# EAGLE design hitpoint (EAGLE 7.3.0)
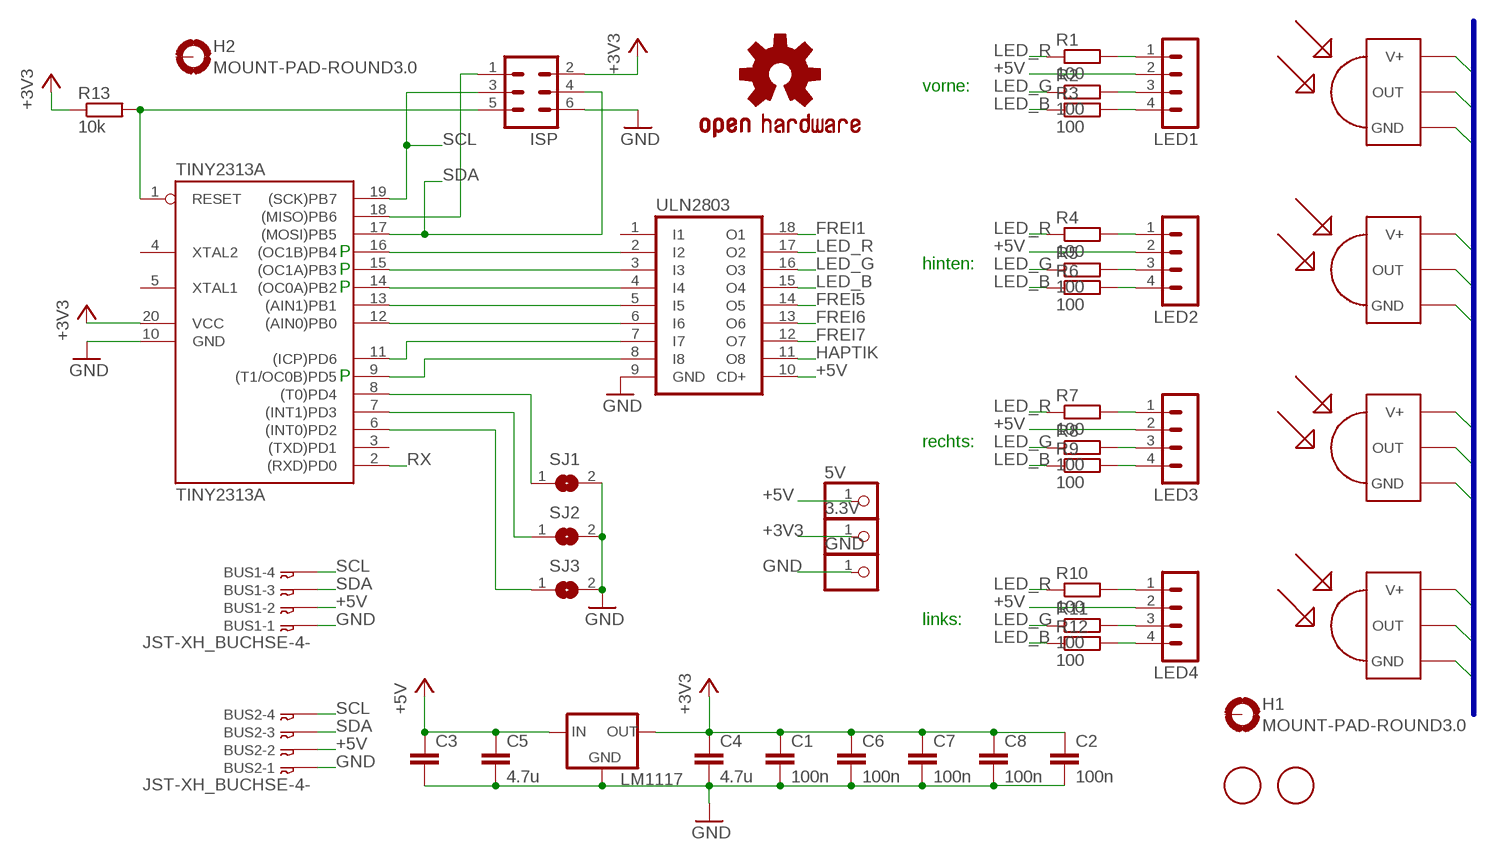
[diagram p0: schematic, sheet 1]

## Parts
3.3V  PIN-HEADER-1  [PIN-HEADER-1]
5V  PIN-HEADER-1  [PIN-HEADER-1]
BUS1  JST-XH_BUCHSE-4-  [JST-XH_BUCHSE-4]
BUS2  JST-XH_BUCHSE-4-  [JST-XH_BUCHSE-4]
C1  100n  C_EU0603  [0603]
C2  100n  C_EU0603  [0603]
C3  C_EUCAP_UNIVERSAL  [C_UNIVERSAL]
C4  4.7u  C_EU0805  [0805]
C5  4.7u  C_EU0805  [0805]
C6  100n  C_EU0603  [0603]
C7  100n  C_EU0603  [0603]
C8  100n  C_EU0603  [0603]
GND  PIN-HEADER-1  [PIN-HEADER-1]
H1  MOUNT-PAD-ROUND3.0  [3,0-PAD]
H2  MOUNT-PAD-ROUND3.0  [3,0-PAD]
ISP  PIN-HEADER-3X2  [PIN-HEADER-3X2]
LED1  PIN-HEADER-4  [PIN-HEADER-4]
LED2  PIN-HEADER-4  [PIN-HEADER-4]
LED3  PIN-HEADER-4  [PIN-HEADER-4]
LED4  PIN-HEADER-4  [PIN-HEADER-4]
LM1117  LM1117_3V3_REGULATOR  [SOT223]
LOGO1  OSHW-LOGOM  [OSHW-LOGO-M]
LOGO2  OSHW-LOGOM  [OSHW-LOGO-M]
R1  100  R_EU0603  [0603]
R2  100  R_EU0603  [0603]
R3  100  R_EU0603  [0603]
R4  100  R_EU0603  [0603]
R5  100  R_EU0603  [0603]
R6  100  R_EU0603  [0603]
R7  100  R_EU0603  [0603]
R8  100  R_EU0603  [0603]
R9  100  R_EU0603  [0603]
R10  100  R_EU0603  [0603]
R11  100  R_EU0603  [0603]
R12  100  R_EU0603  [0603]
R13  10k  R_EU0603  [0603]
SJ1  SJ  [SJ]
SJ2  SJ  [SJ]
SJ3  SJ  [SJ]
TINY2313A  TINY2313A  [SO20LVERSTUMMELT]
U$1  TSOP4338  [TSOP4338]
U$2  TSOP4338  [TSOP4338]
U$3  TSOP4338  [TSOP4338]
U$4  TSOP4338  [TSOP4338]
U$5  FIDUCIAL  [FIDUCIAL_1MM]
U$6  FIDUCIAL  [FIDUCIAL_1MM]
ULN2803  ULN2803ASO18  [SO18W]

## Nets
+3V3: 3.3V.1 C1.1 C2.1 C4.1 C6.1 C7.1 C8.1 ISP.2 LM1117.2(OUT) LM1117.4(OUT) R13.1 TINY2313A.20(VCC) U$1.VCC(V+) U$2.VCC(V+) U$3.VCC(V+) U$4.VCC(V+)
+5V: 5V.1 BUS1.P$2 BUS2.P$2 C3.1 C3.1B C5.1 LED1.2 LED2.2 LED3.2 LED4.2 LM1117.3(IN) ULN2803.10(CD+)
FREI1: ULN2803.18(O1)
FREI5: ULN2803.14(O5)
FREI6: ULN2803.13(O6)
FREI7: ULN2803.12(O7)
GND: BUS1.P$1 BUS2.P$1 C1.2 C2.2 C3.2 C3.2B C4.2 C5.2 C6.2 C7.2 C8.2 GND.1 ISP.6 LM1117.1(GND) SJ1.2 SJ2.2 SJ3.2 TINY2313A.10(GND) U$1.GND U$2.GND U$3.GND U$4.GND ULN2803.9(GND)
HAPTIK: ULN2803.11(O8)
LED_B: R3.1 R6.1 R9.1 R12.1 ULN2803.15(O4)
LED_G: R2.1 R5.1 R8.1 R11.1 ULN2803.16(O3)
LED_R: R1.1 R4.1 R7.1 R10.1 ULN2803.17(O2)
N$1: ISP.1 TINY2313A.18((MISO)PB6)
N$2: SJ1.1 TINY2313A.8((T0)PD4)
N$3: TINY2313A.16((OC1B)PB4) ULN2803.2(I2)
N$4: TINY2313A.15((OC1A)PB3) ULN2803.3(I3)
N$5: LED4.1 R10.2
N$6: LED4.3 R11.2
N$7: TINY2313A.14((OC0A)PB2) ULN2803.4(I4)
N$8: TINY2313A.13((AIN1)PB1) ULN2803.5(I5)
N$9: TINY2313A.12((AIN0)PB0) ULN2803.6(I6)
N$10: TINY2313A.11((ICP)PD6) ULN2803.7(I7)
N$11: TINY2313A.9((T1/OC0B)PD5) ULN2803.8(I8)
N$12: LED4.4 R12.2
N$13: LED3.1 R7.2
N$14: LED3.3 R8.2
N$15: LED3.4 R9.2
N$16: LED2.1 R4.2
N$17: LED2.3 R5.2
N$18: SJ2.1 TINY2313A.7((INT1)PD3)
N$19: SJ3.1 TINY2313A.6((INT0)PD2)
N$22: LED2.4 R6.2
N$23: ISP.5 R13.2 TINY2313A.1(RESET)
N$24: LED1.1 R1.2
N$25: LED1.3 R2.2
N$26: LED1.4 R3.2
RX: TINY2313A.2((RXD)PD0) U$1.OUT U$2.OUT U$3.OUT U$4.OUT
SCL: BUS1.P$4 BUS2.P$4 ISP.3 TINY2313A.19((SCK)PB7)
SDA: BUS1.P$3 BUS2.P$3 ISP.4 TINY2313A.17((MOSI)PB5)
Unconnected: H1.B3,0(MOUNT) H2.B3,0(MOUNT) TINY2313A.3((TXD)PD1) TINY2313A.4(XTAL2) TINY2313A.5(XTAL1) ULN2803.1(I1)

## Buses
+3V3,GND,RX

## Notes on the sheet
- vorne:
- P
- hinten:
- P
- P
- P
- rechts:
- links:

## Library data of the parts
3.3V 5V GND = wz:PIN-HEADER-1: PIN HEADER
BUS1 BUS2 = wz:JST-XH_BUCHSE-4: JST CONNECTOR
C1-C8 = wz:C_EU: CAPACITOR, European symbol
H1 H2 = holes:MOUNT-PAD-ROUND: MOUNTING PAD, round
ISP = wz:PIN-HEADER-3X2: PIN HEADER; OC_FARNELL: unknown; OC_NEWARK: unknown
LED1-LED4 = wz:PIN-HEADER-4: PIN HEADER; OC_FARNELL: unknown; OC_NEWARK: unknown
LM1117 = wz:LM1117_3V3_REGULATOR: 1117
LOGO1 LOGO2 = SparkFun-Aesthetics:OSHW-LOGO: Open Source Hardware Logo This logo indicates the piece of hardware it is found on incorporates a OSHW license and/or adheres to the definition of open source hardware found here: http://freedomdefined.org/OSHW
R1-R13 = wz:R_EU: RESISTOR, European symbol
SJ1-SJ3 = jumper:SJ: SMD solder JUMPER
TINY2313A = wz:TINY2313A: MICROCONTROLLER 2 Kbytes FLASH 128 bytes SRAM 128 bytes EEPROM UART
U$1-U$4 = wz:TSOP4338: IR Receiver and Demodulator
U$5 U$6 = adafruit:FIDUCIAL: For use by pick and place machines to calibrate the vision/machine, 1mm By microbuilder.eu
ULN2803 = wz:ULN2803A: DRIVER ARRAY

## Net classes
0 default: width 0.016 mm

## Board
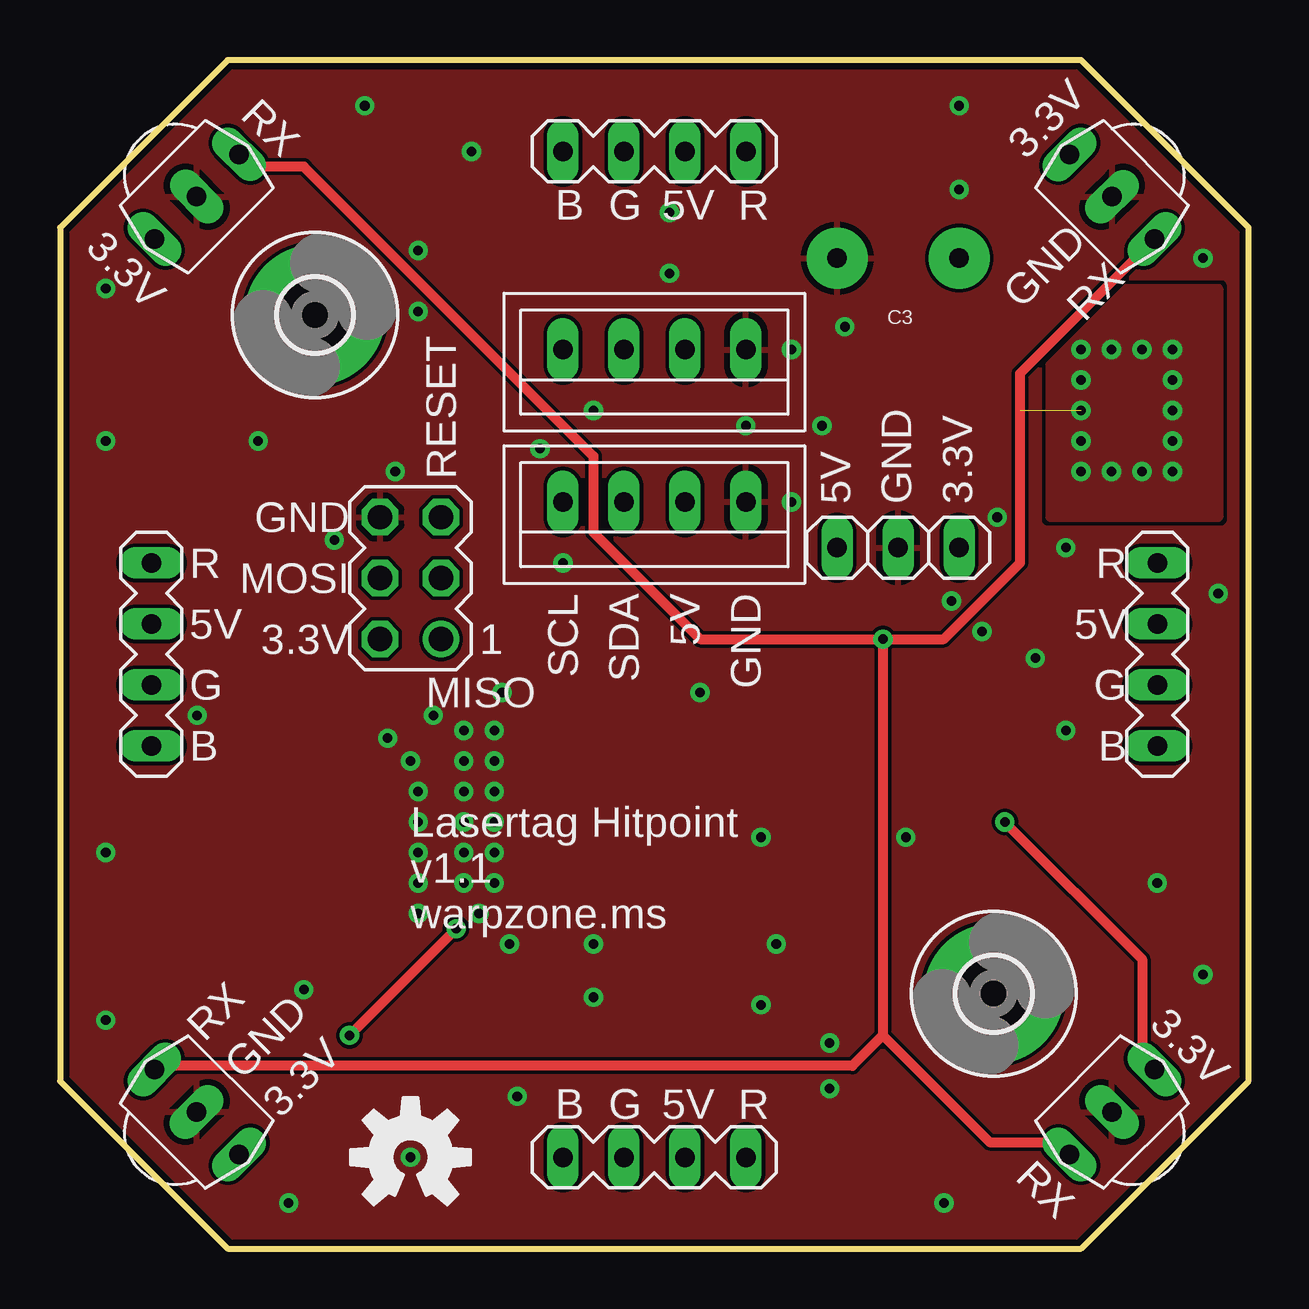
[diagram p1: board, top side]
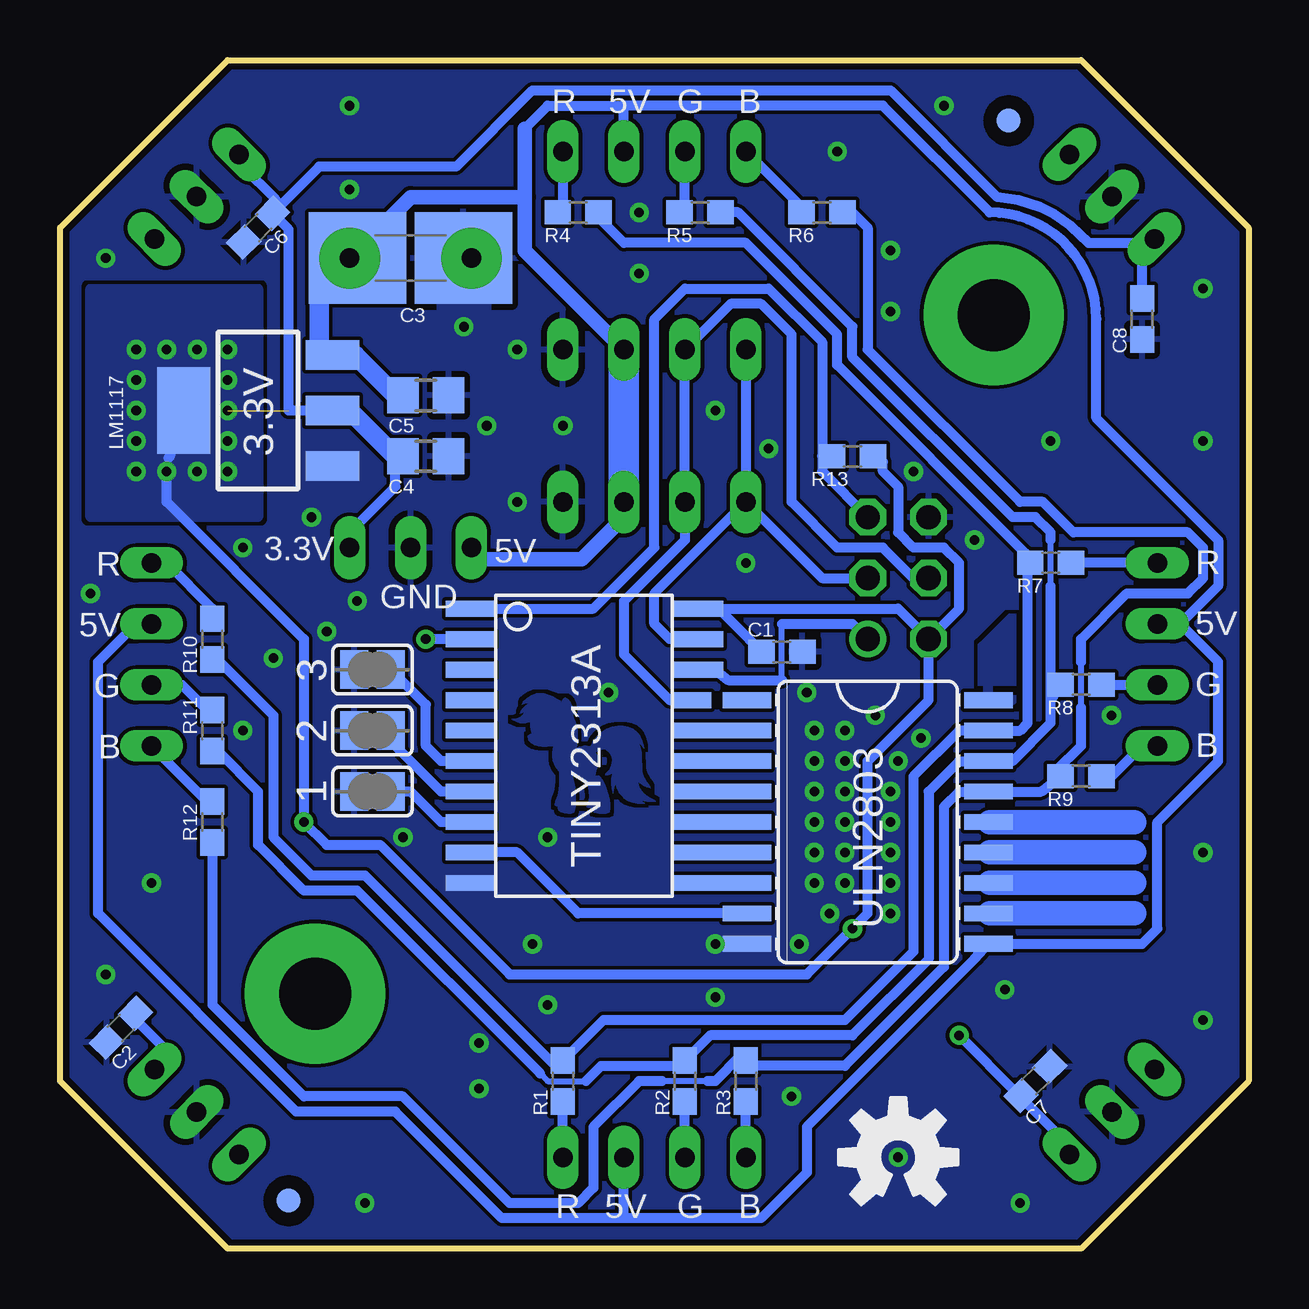
[diagram p2: board, bottom side, seen from below]

Size 49.53 x 49.53 mm. Coordinates in mm from the lower left corner, seen from the top.
Outline: 6.99,49.53 42.55,49.53 49.53,42.55 49.53,6.99 42.55,0 6.99,0 0,6.99 0,42.55 6.99,49.52
Copper layers (1*16): Top 0.035mm / dielectric 1.5mm / Bottom 0.035mm
Design rules "ITEADstudio_DRC *": minimum track width 6mil, minimum drill 12mil, track to track 6mil, track to pad 6mil, pad to pad 6mil, via to via 6mil, smd to smd 0mil, copper to edge 10mil, drill to drill 10mil, minimum pad ring 10mil, minimum via ring 6mil, stop-mask expansion 2mil, vias tented up to drill 100mil, thermal gap 10mil

### Footprints (pad centres in the part's own frame; a part is rotated, then mirrored left to right if it is on the bottom)
PIN-HEADER-1 = drill 0.813 long: 1 0,0
JST-XH_BUCHSE-4 = drill 0.813 long: P$1 -3.81,0; P$2 -1.27,0; P$3 1.27,0; P$4 3.81,0
0603 = smd 1.1 x 1: 1 -0.85,0; 2 0.85,0
C_UNIVERSAL = smd 4.064 x 3.81: 1 -2.204,0; 2 2.204,0 | drill 0.813 pad 2.54: 1B -2.54,0; 2B 2.54,0
0805 = smd 1.3 x 1.5: 1 -0.95,0; 2 0.95,0
3,0-PAD = drill 3 pad 5.842: B3,0 0,0
PIN-HEADER-3X2 = drill 1.016: 1 -2.54,-1.27 | drill 1.016 octagon: 2 -2.54,1.27; 3 0,-1.27; 4 0,1.27; 5 2.54,-1.27; 6 2.54,1.27
PIN-HEADER-4 = drill 0.813 long: 1 -3.81,0; 2 -1.27,0; 3 1.27,0; 4 3.81,0
SOT223 = smd 1.219 x 2.235: 1 -2.311,-3.099; 2 0,-3.099; 3 2.311,-3.099 | smd 3.6 x 2.2: 4 0,3.099
SJ = smd 1.168 x 1.6: 1 -0.762,0; 2 0.762,0
SO20LVERSTUMMELT = smd 0.66 x 2.032: 1 -5.08,-5.131; 2 -3.81,-5.131; 3 -2.54,-5.131; 4 -1.27,-5.131; 5 0,-5.131; 6 1.27,-5.131; 7 2.54,-5.131; 8 3.81,-5.131; 9 5.08,-5.131; 10 6.35,-5.131; 11 6.35,4.394; 12 5.08,4.394; 13 3.81,4.394; 14 2.54,4.394; 15 1.27,4.394; 16 0,4.394; 18 -2.54,4.394; 19 -3.81,4.394; 20 -5.08,4.394 | smd 0.66 x 1.524: 17 -1.27,4.14
TSOP4338 = drill 0.813 long: GND -0.001,-0.027; OUT -2.501,-0.027; VCC 2.499,-0.027
FIDUCIAL_1MM = smd 1 x 1: 1 0,0
SO18W = smd 0.66 x 2.032: 1 -5.08,-5.029; 2 -3.81,-5.029; 3 -2.54,-5.029; 4 -1.27,-5.029; 5 0,-5.029; 6 1.27,-5.029; 7 2.54,-5.029; 8 3.81,-5.029; 9 5.08,-5.029; 10 5.08,5.029; 11 3.81,5.029; 12 2.54,5.029; 13 1.27,5.029; 14 0,5.029; 15 -1.27,5.029; 16 -2.54,5.029; 17 -3.81,5.029; 18 -5.08,5.029

### Placement (x,y rotation side)
3.3V  37.47,29.21 0 top
5V  32.38,29.21 0 top
BUS1  24.77,37.47 180 top
BUS2  24.77,31.11 180 top
C1  19.45,24.86 0 bottom
C2  46.99,9.21 225 bottom
C3  34.92,41.27 0 bottom
C4  34.29,33.02 0 bottom
C5  34.29,35.56 0 bottom
C6  41.27,42.55 225 bottom
C7  8.89,6.99 45 bottom
C8  4.45,38.73 270 bottom
GND  34.92,29.21 0 top
H1  10.62,38.91 0 top
H2  38.91,10.62 0 top
ISP  14.61,27.94 90 top
LED1  24.77,3.81 180 top
LED2  24.77,45.72 180 top
LED3  3.81,24.77 270 top
LED4  45.72,24.77 270 top
LM1117  41.27,34.92 90 bottom
LOGO1  14.61,3.81 0 top
LOGO2  14.61,3.81 0 bottom
R1  28.57,6.99 270 bottom
R2  23.5,6.99 270 bottom
R3  20.95,6.99 270 bottom
R4  27.94,43.18 180 bottom
R5  22.86,43.18 180 bottom
R6  17.78,43.18 180 bottom
R7  8.26,28.57 0 bottom
R8  6.99,23.5 0 bottom
R9  6.99,19.68 0 bottom
R10  43.18,25.4 90 bottom
R11  43.18,21.59 90 bottom
R12  43.18,17.78 90 bottom
R13  16.51,33.02 180 bottom
SJ1  36.51,19.05 180 bottom
SJ2  36.51,21.59 180 bottom
SJ3  36.51,24.13 180 bottom
TINY2313A  27.3,21.59 270 bottom
U$1  43.81,43.81 135 top
U$2  5.71,43.81 225 top
U$3  5.71,5.71 315 top
U$4  43.81,5.71 45 top
U$5  10,47 0 bottom
U$6  40,2 0 bottom
ULN2803  15.88,17.78 270 bottom

### Tracks (layer width: path | path; a pad name or v marks a point on that pad's centre or on a via)
+3V3  (via drill 0.4, 0.4 pad 0.41)  (1 unrouted)
  Top 0.406: v39.37,17.78 45.09,12.06 45.09,7.98 U$4.VCC | v12.06,8.89 v16.51,13.34
  Bottom 0.406: LM1117.2 40.01,34.92 40.01,42.48 C6.1 | TINY2313A.20 22.09,26.67 | 22.09,26.67 14.61,26.67 ISP.2 | LM1117.4 45.01,32.94 | ISP.2 13.34,22.86 15.88,20.32 15.88,13.97 v16.51,13.34 18.41,11.43 30.8,11.43 36.2,16.83 38.42,16.83 v39.37,17.78 39.37,25.4 45.09,31.11 v45.09,32.38 | C6.1 40.55,43.72 41.91,45.09 41.91,45.44 U$1.VCC | C6.1 38.73,45.09 33.02,45.09 29.84,48.26 14.92,48.26 10.48,43.81 9.6,43.7 8.7,43.4 8.1,43.09 7.39,42.59 6.67,41.91 4.09,41.91 | ISP.2 12.06,26.67 12.06,28.57 12.7,29.21 13.97,29.21 14.61,29.84 14.61,31.75 15.24,32.38 15.24,32.78 R13.1 | C1.1 20.79,25.37 22.09,26.67 | C2.1 46.26,9.43 45.09,8.26 45.09,7.98 U$4.VCC | v12.06,8.89 9.62,6.44 C7.1 9.49,6.32 7.62,4.45 7.62,4.09 U$3.VCC | C8.1 4.45,41.55 4.09,41.91 | 4.09,41.91 U$2.VCC | 3.3V.1 37.47,29.84 35.56,31.75 35.56,32.7 C4.1
  Bottom 0.813: LM1117.2 37.47,34.92 35.56,33.02 C4.1
  other vias: 46.35,36.2 46.35,37.47 45.09,37.47 42.55,37.47 46.35,32.38 42.55,33.66 43.81,32.38 46.35,33.66 42.55,32.38 42.55,36.2 42.55,34.92 43.81,37.47 46.35,34.92
  pour Bottom (no thermals): 41.27,40.01 41.27,30.48 48.26,30.48 48.26,40.01
  pour Top: 48.26,40.01 48.26,30.48 41.27,30.48 41.27,36.83 44.45,40.01
+5V
  Bottom 0.406: 26.04,1.27 20.32,1.27 18.41,3.17 18.41,5.08 11.43,12.06 ULN2803.10 4.45,12.7 3.81,13.34 3.81,17.78 1.27,20.32 1.27,24.45 2.86,26.04 | 26.04,1.27 LED1.2 | LED2.2 26.04,47.62 | 26.04,47.62 15.24,47.62 10.79,43.18 arc90 6.35,38.73 6.35,34.61 1.27,29.53 1.27,27.62 2.86,26.04 | 35.56,40.64 36.2,42.55 | 30.16,46.67 29.21,47.62 26.04,47.62 | LED4.2 46.35,26.04 47.94,24.45 47.94,13.97 39.69,5.71 35.56,5.71 31.11,1.27 26.04,1.27 | 2.86,26.04 LED3.2 | LM1117.3 38.18,37.39 | C3.1B C3.1
  Bottom 0.61: 30.16,43.81 34.92,43.81 36.2,42.55 36.2,42.21 C3.1 | 30.16,43.81 30.16,46.67 | 30.16,43.81 30.16,41.59 BUS1.P$2 | 5V.1 31.91,28.73 27.78,28.73 26.04,30.48 BUS2.P$2
  Bottom 0.813: C5.1 35.56,35.56 37.24,37.24 LM1117.3 38.51,37.24 38.73,37.47 38.73,40.64 37.76,40.64 C3.1
  Bottom 1.27: BUS2.P$2 BUS1.P$2
FREI1
  pour Bottom (isolate 0.264): 9.84,22.86 9.84,26.35 11.11,25.08 11.11,22.86
FREI5
  Bottom 0.406: 10.79,17.78 ULN2803.14
  Bottom 1.016: 10.79,17.78 4.76,17.78
FREI6
  Bottom 0.406: 10.79,16.51 ULN2803.13
  Bottom 1.016: 10.79,16.51 4.76,16.51
FREI7
  Bottom 0.406: ULN2803.12 10.79,15.24
  Bottom 1.016: 10.79,15.24 4.76,15.24
GND  (via drill 0.4)
  other vias: 1.91,40.01 8.26,33.66 17.14,45.72 12.7,47.62 25.4,43.18 25.4,40.64 37.47,44.13 37.47,47.62 1.91,16.51 1.91,9.53 9.53,1.91 14.61,3.81 36.83,1.91 47.62,11.43 45.72,15.24 48.26,27.3 40.64,24.61 37.15,26.99 47.62,41.27 1.91,33.66 32.07,6.67 32.07,8.57 29.21,10.16 29.84,12.7 22.23,12.7 16.83,16.51 14.92,16.51 22.23,10.48 18.41,23.18 29.21,17.14 26.67,23.18 20.95,28.57 28.57,34.29 32.7,38.42 30.48,37.47 30.48,31.11 11.43,29.53 13.97,32.38 10.16,10.79 31.75,34.29 39.05,30.48 41.91,21.59 5.71,22.23 41.91,29.21 14.92,41.59 14.92,39.05 22.23,34.92 20,33.34 19.05,6.35 35.24,17.14 16.83,15.24 16.83,17.78 16.83,19.05 16.83,20.32 14.92,17.78 14.92,19.05 14.92,15.24 14.92,13.97 17.46,13.97 16.83,21.59 14.61,20.32 13.65,21.27 18.1,15.24 18.1,16.51 18.1,17.78 18.1,19.05 18.1,20.32 18.1,21.59 15.56,22.23 18.73,12.7 38.42,25.72
  pour Bottom (rank 6): 0,42.55 6.99,49.53 42.55,49.53 49.53,42.55 49.53,6.99 42.55,0 6.99,0 0,6.99
  pour Bottom (no thermals): 36.2,34.29 40.01,34.29 40.01,30.48 36.2,30.48
  pour Bottom (no thermals): 19.05,13.34 22.23,13.34 22.23,12.06 19.05,12.06
  pour Bottom (no thermals): 31.11,16.51 34.29,16.51 34.29,14.61 31.11,14.61
  pour Bottom (no thermals): 31.75,40.01 33.66,40.01 33.66,38.73 31.75,38.73
  pour Top (rank 6): 0,42.55 0,6.99 6.99,0 42.55,0 49.53,6.99 49.53,42.55 42.55,49.53 6.99,49.53
HAPTIK
  Bottom 0.406: 10.79,13.97 ULN2803.11
  Bottom 1.016: 10.79,13.97 4.76,13.97
LED_B
  Bottom 0.254: 22.54,6.99 24.45,6.99 | 6.99,22.54 6.99,24.45
  Bottom 0.406: 22.54,6.99 22.23,6.99 21.2,8.01 R3.1 20.71,7.62 16.83,7.62 12.7,11.75 12.7,18.41 12.06,19.05 ULN2803.15 8.65,19.05 R9.1 8.01,19.93 6.99,20.95 6.99,22.54 | 24.45,6.99 25.4,6.99 27.3,5.08 27.3,2.54 27.94,1.91 30.8,1.91 35.24,6.35 39.37,6.35 43.18,10.16 R12.1 | 6.99,24.45 6.99,25.4 5.08,27.3 2.54,27.3 1.91,27.94 1.91,29.21 2.54,29.84 7.3,29.84 8.57,31.11 9.53,31.11 15.88,37.47 15.88,42.55 16.51,43.18 R6.1
LED_G
  Bottom 0.254: 29.53,7.3 29.21,6.99 27.62,6.99 | 8.26,27.62 8.26,29.53
  Bottom 0.406: 29.53,7.3 37.15,14.92 39.37,14.92 41.27,16.83 41.27,19.05 42.97,20.74 R11.1 | 8.26,22.86 8.26,21.91 9.84,20.32 ULN2803.16 12.06,20.32 13.34,19.05 13.34,12.06 16.51,8.89 22.44,8.89 R2.1 23.71,7.62 26.99,7.62 27.62,6.99 | 8.26,22.86 8.26,27.62 | 8.26,29.53 8.26,29.84 8.89,30.48 9.84,30.48 16.51,37.15 16.51,38.42 21.27,43.18 R5.1 | R8.1 8.26,22.86
LED_R
  Bottom 0.406: 9.28,28.82 9.28,28.97 17.14,36.83 17.14,38.1 20.95,41.91 26.04,41.91 27.09,42.97 R4.1 | 28.82,7.62 28.89,7.62 36.83,15.56 39.05,15.56 40.64,17.14 40.64,22.23 42.97,24.55 R10.1 | 28.57,7.62 28.82,7.62 | 28.82,7.62 R1.1 26.89,9.53 16.83,9.53 13.97,12.38 13.97,19.68 12.06,21.59 ULN2803.17 9.53,21.59 9.21,21.91 9.21,28.26 9.28,28.82 | R7.1 9.28,28.82
N$1
  Bottom 0.254: 19.45,23.7 19.45,26.04
  Bottom 0.406: TINY2313A.18 22.23,24.13 21.69,23.7 19.45,23.7 | 19.45,26.04 16.51,26.04 ISP.1
N$2
  Bottom 0.406: TINY2313A.8 33.66,17.78 34.92,19.05 SJ1.1
N$3
  Bottom 0.406: ULN2803.2 TINY2313A.16
N$4
  Bottom 0.406: ULN2803.3 TINY2313A.15
N$5
  Bottom 0.406: 43.4,26.25 R10.2 43.18,26.67 45.09,28.57 LED4.1
N$6
  Bottom 0.406: R11.2 43.4,22.44 44.45,23.5 LED4.3
N$7
  Bottom 0.406: ULN2803.4 TINY2313A.14
N$8
  Bottom 0.406: ULN2803.5 TINY2313A.13
N$9
  Bottom 0.406: ULN2803.6 TINY2313A.12
N$10
  Bottom 0.406: ULN2803.7 TINY2313A.11
N$11
  Bottom 0.406: ULN2803.8 27.94,13.97 30.48,16.51 TINY2313A.9
N$12
  Bottom 0.406: R12.2 43.4,18.63 LED4.4
N$13
  Bottom 0.406: LED3.1 R7.2
N$14
  Bottom 0.406: R8.2 LED3.3
N$15
  Bottom 0.406: R9.2 5.71,19.68 4.45,20.95 LED3.4
N$16
  Bottom 0.406: LED2.1 28.57,43.4 R4.2
N$17
  Bottom 0.406: LED2.3 23.5,43.4 R5.2
N$18
  Bottom 0.406: TINY2313A.7 33.66,19.05 35.56,20.95 35.56,21.14 SJ2.1 35.43,20.83
N$19
  Bottom 0.406: TINY2313A.6 33.66,20.32 34.29,20.95 34.29,22.67 SJ3.1
N$22
  Bottom 0.406: R6.2 18.63,43.4 LED2.4
N$23
  Bottom 0.406: TINY2313A.1 27.3,26.67 24.77,29.21 24.77,38.73 23.5,40.01 20,40.01 17.78,37.78 17.78,33.02 | 17.78,33.02 17.78,32.38 ISP.5 | R13.2 17.78,33.02
N$24
  Bottom 0.406: LED1.1 R1.2
N$25
  Bottom 0.406: LED1.3 R2.2
N$26
  Bottom 0.406: LED1.4 R3.2
N$30
  pour Bottom: 225 corners
RX  (via drill 0.4)
  Top 0.406: v34.29,25.4 36.83,25.4 40.01,28.57 40.01,36.47 U$1.OUT | v34.29,25.4 34.29,8.89 | 34.29,8.89 38.73,4.45 41.55,4.45 U$4.OUT | v34.29,25.4 26.67,25.4 22.23,29.84 22.23,33.02 10.16,45.09 7.98,45.09 U$2.OUT | 34.29,8.89 33.02,7.62 4.08,7.62 U$3.OUT
  Bottom 0.406: TINY2313A.2 v34.29,25.4
SCL
  Bottom 0.406: ISP.3 17.78,27.94 BUS2.P$4 | TINY2313A.19 24.13,25.4 24.77,26.04 24.77,27.3 BUS2.P$4 | BUS1.P$4 BUS2.P$4
SDA
  Bottom 0.406: TINY2313A.17 24.13,22.86 26.04,24.77 26.04,26.99 23.5,29.53 BUS2.P$3 BUS1.P$3 21.59,39.37 20.32,39.37 19.05,38.1 19.05,31.11 17.14,29.21 15.24,29.21 13.97,27.94 ISP.4

### Text on the board
tNames: 3.3V | RX | 3.3V | B | G | 5V | R | GND | RX | RESET | GND | R | R | MOSI | SCL | SDA | 5V | GND | 5V | 3.3V | 1 | 5V | G | MISO | G | B | B | Lasertag Hitpoint / v1.1 / warpzone.ms | RX | GND | 3.3V | 3.3V | B | G | 5V | R | RX
bNames: B | G | 5V | R | C3 | 3.3V | 5V | R | R | GND | 5V | 5V | G | G | B | B | B | G | 5V | R
_bsilk: 3.3V | 3 | 2 | 1 | TINY2313A | ULN2803